# EAGLE design hw2 (EAGLE 9.3.0)
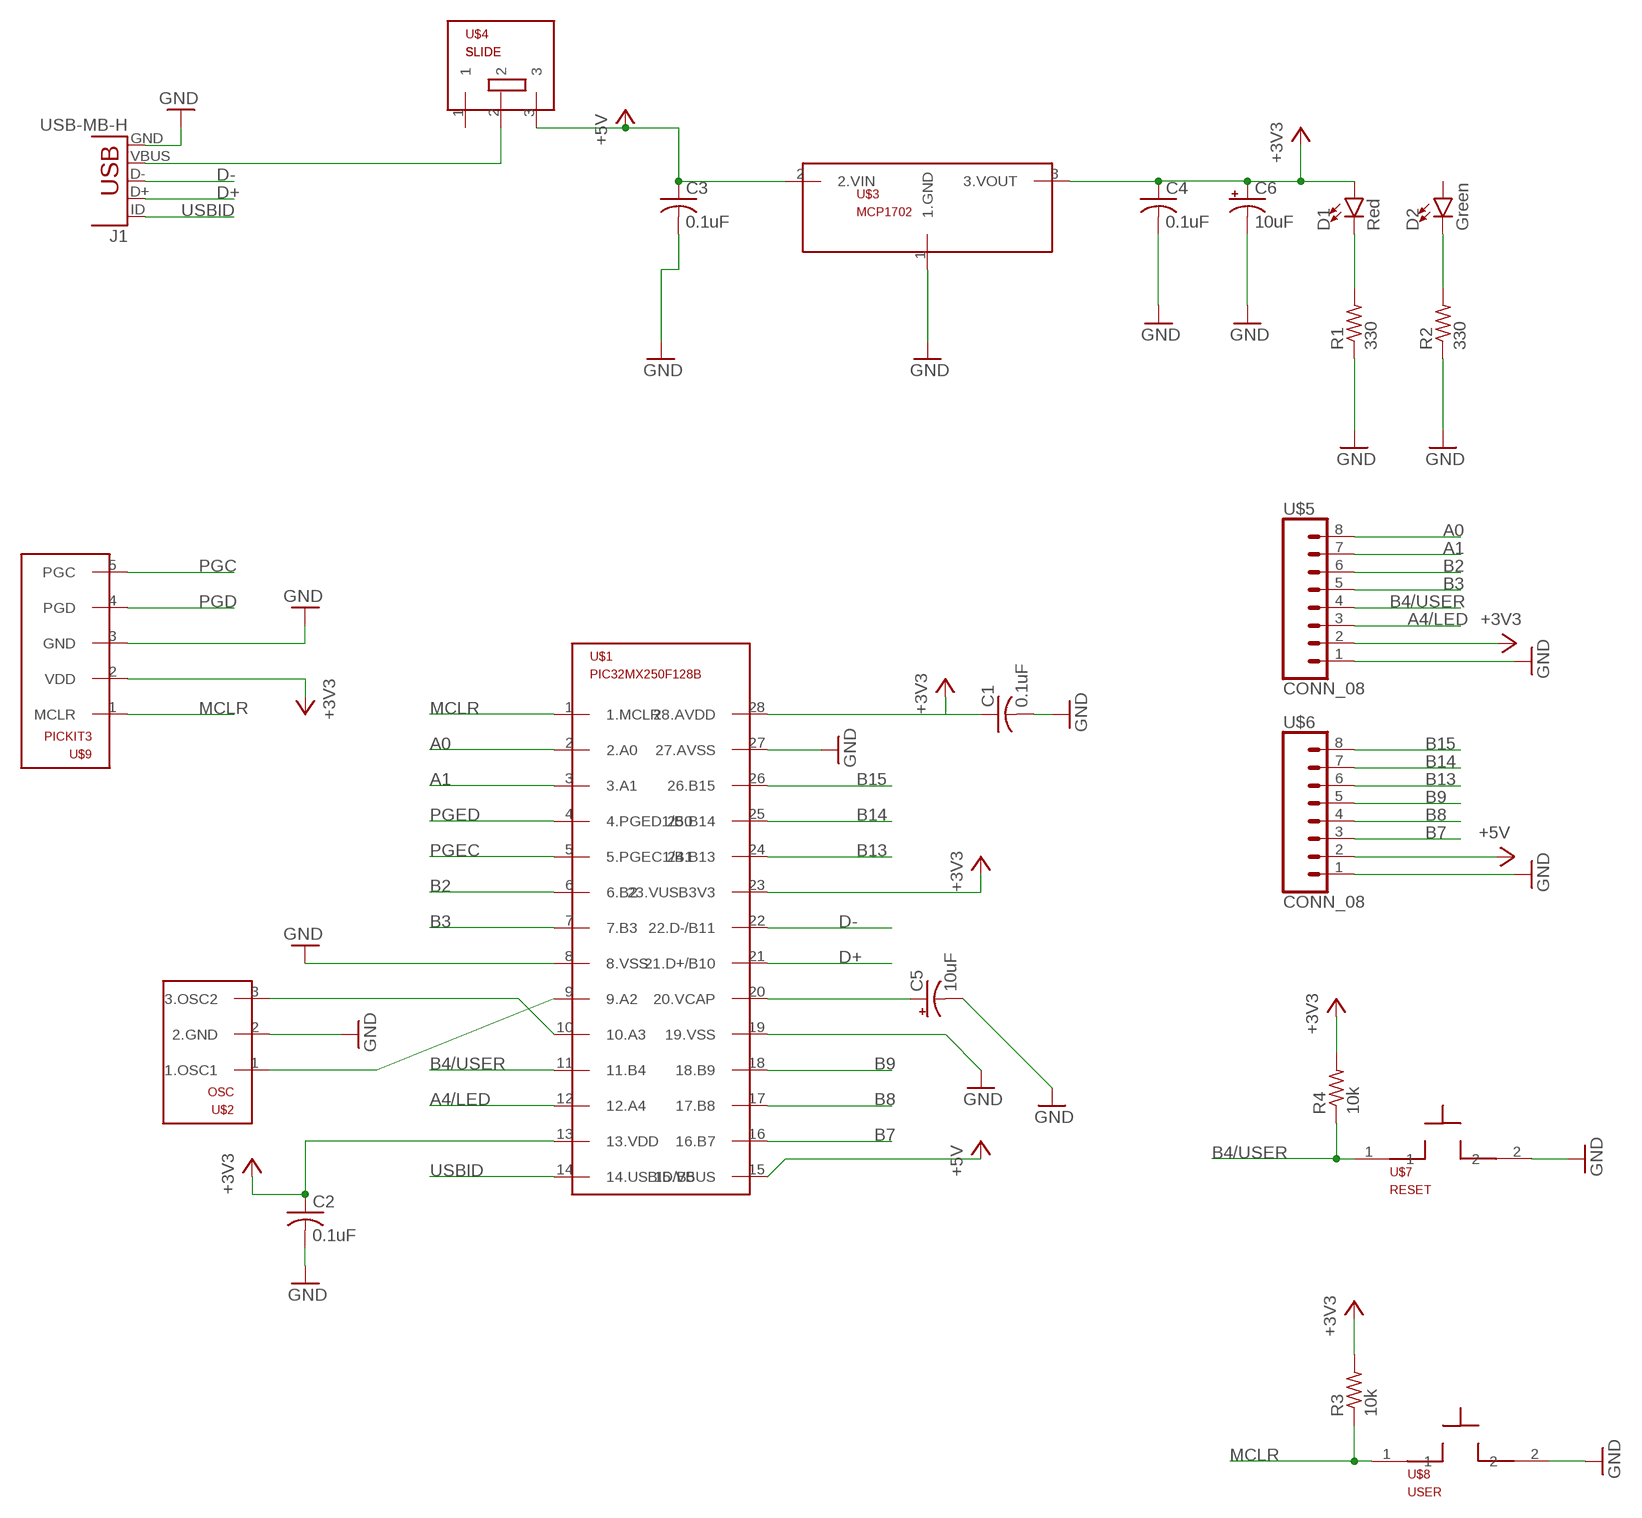
[diagram p0: schematic, sheet 1]

## Parts
C1  0.1uF  C-US025-025X050  [C025-025X050]
C2  0.1uF  C-US025-025X050  [C025-025X050]
C3  0.1uF  C-US025-025X050  [C025-025X050]
C4  0.1uF  C-US025-025X050  [C025-025X050]
C5  10uF  CPOL-USB45181B  [B45181B]
C6  10uF  CPOL-USB45181B  [B45181B]
D1  Red  LED3MM  [LED_3MM]
D2  Green  LED3MM  [LED_3MM]
J1  USB-MB-H  [USB-MB-H]
R1  330  R-US_0207/10  [0207/10]
R2  330  R-US_0207/10  [0207/10]
R3  10k  R-US_0207/10  [0207/10]
R4  10k  R-US_0207/10  [0207/10]
U$1  PIC32MX250F128B  [DIL28-3]
U$2  OSC  [OSC]
U$3  MCP1702  [TO92]
U$4  SLIDE  [SLIDE]
U$5  CONN_08  [1X08]
U$6  CONN_08  [1X08]
U$7  RESET  PB  [PB]
U$8  USER  PB  [PB]
U$9  PICKIT3  [1X05]

## Nets
+3V3: C2.1 C4.1 C6.+ D1.A R3.2 R4.2 U$1.13(13.VDD) U$1.23(23.VUSB3V3) U$3.3(3.VOUT) U$5.2 U$9.2(VDD)
+5V: C3.1 U$1.15(15.VBUS) U$3.2(2.VIN) U$4.3 U$6.2
A0: U$1.2(2.A0) U$5.8
A1: U$1.3(3.A1) U$5.7
A4/LED: U$1.12(12.A4) U$5.3
B2: U$1.6(6.B2) U$5.6
B3: U$1.7(7.B3) U$5.5
B4/USER: R4.1 U$1.11(11.B4) U$5.4 U$7.1
B7: U$1.16(16.B7) U$6.3
B8: U$1.17(17.B8) U$6.4
B9: U$1.18(18.B9) U$6.5
B13: U$1.24(24.B13) U$6.6
B14: U$1.25(25.B14) U$6.7
B15: U$1.26(26.B15) U$6.8
D+: J1.D+ U$1.21(21.D+/B10)
D-: J1.D- U$1.22(22.D-/B11)
GND: C1.2 C2.2 C3.2 C4.2 C5.- C6.- J1.GND R1.1 R2.1 U$1.8(8.VSS) U$1.19(19.VSS) U$1.27(27.AVSS) U$2.2(2.GND) U$3.1(1.GND) U$5.1 U$6.1 U$7.2 U$8.2 U$9.3(GND)
MCLR: R3.1 U$1.1(1.MCLR) U$8.1 U$9.1(MCLR)
N$1: J1.VBUS U$4.2
N$2: D1.K(C) R1.2
N$3: D2.K(C) R2.2
N$4: U$1.9(9.A2) U$2.1(1.OSC1)
N$5: U$1.10(10.A3) U$2.3(3.OSC2)
N$7: C5.+ U$1.20(20.VCAP)
N$26: C1.1 U$1.28(28.AVDD)
PGC: U$9.5(PGC)
PGD: U$9.4(PGD)
PGEC: U$1.5(5.PGEC1/B1)
PGED: U$1.4(4.PGED1/B0)
USBID: J1.ID U$1.14(14.USBID/B5)
Unconnected: D2.A U$4.1

## Library data of the parts
C1 C2 C4 = hw2:C-US: CAPACITOR, American symbol; SPICEPREFIX: C
C3 = hw2:C-US: CAPACITOR, American symbol; SPICEPREFIX: 0.1uF
C5 C6 = hw2:CPOL-US: POLARIZED CAPACITOR, American symbol; SPICEPREFIX: C
D1 D2 = SparkFun-LED:LED: LED (Generic) Standard schematic elements and footprints for 5mm, 3mm, 1206, and 0603 sized LEDs. Generic LEDs with no color specified.; PROD_ID: DIO-08794
J1 = hw2:USB: USB Connectors USB-B-PTH is fully proven SKU : PRT-00139/CONN-08278 USB-miniB is fully proven SKU : PRT-00587 USB-A-PCB is untested. USB-A-H is throughly reviewed, but untested. Spark Fun Electronics SKU : PRT-00437 USB-B-SMT is throughly reviewed, but untested. Needs silkscreen touching up. USB-A-S has not been used/tested USB-MB-H has not been used/tested USB-MICROB has been used. CONN-09505
R1-R4 = hw2:R-US_: RESISTOR, American symbol; SPICEPREFIX: R
U$1 = hw2:PIC32MX250F128B
U$2 = hw2:OSC
U$3 = hw2:MCP1702
U$4 = hw2:SLIDE
U$5 U$6 = hw2:CONN_08
U$7 U$8 = hw2:PB
U$9 = hw2:PICKIT3

## Board
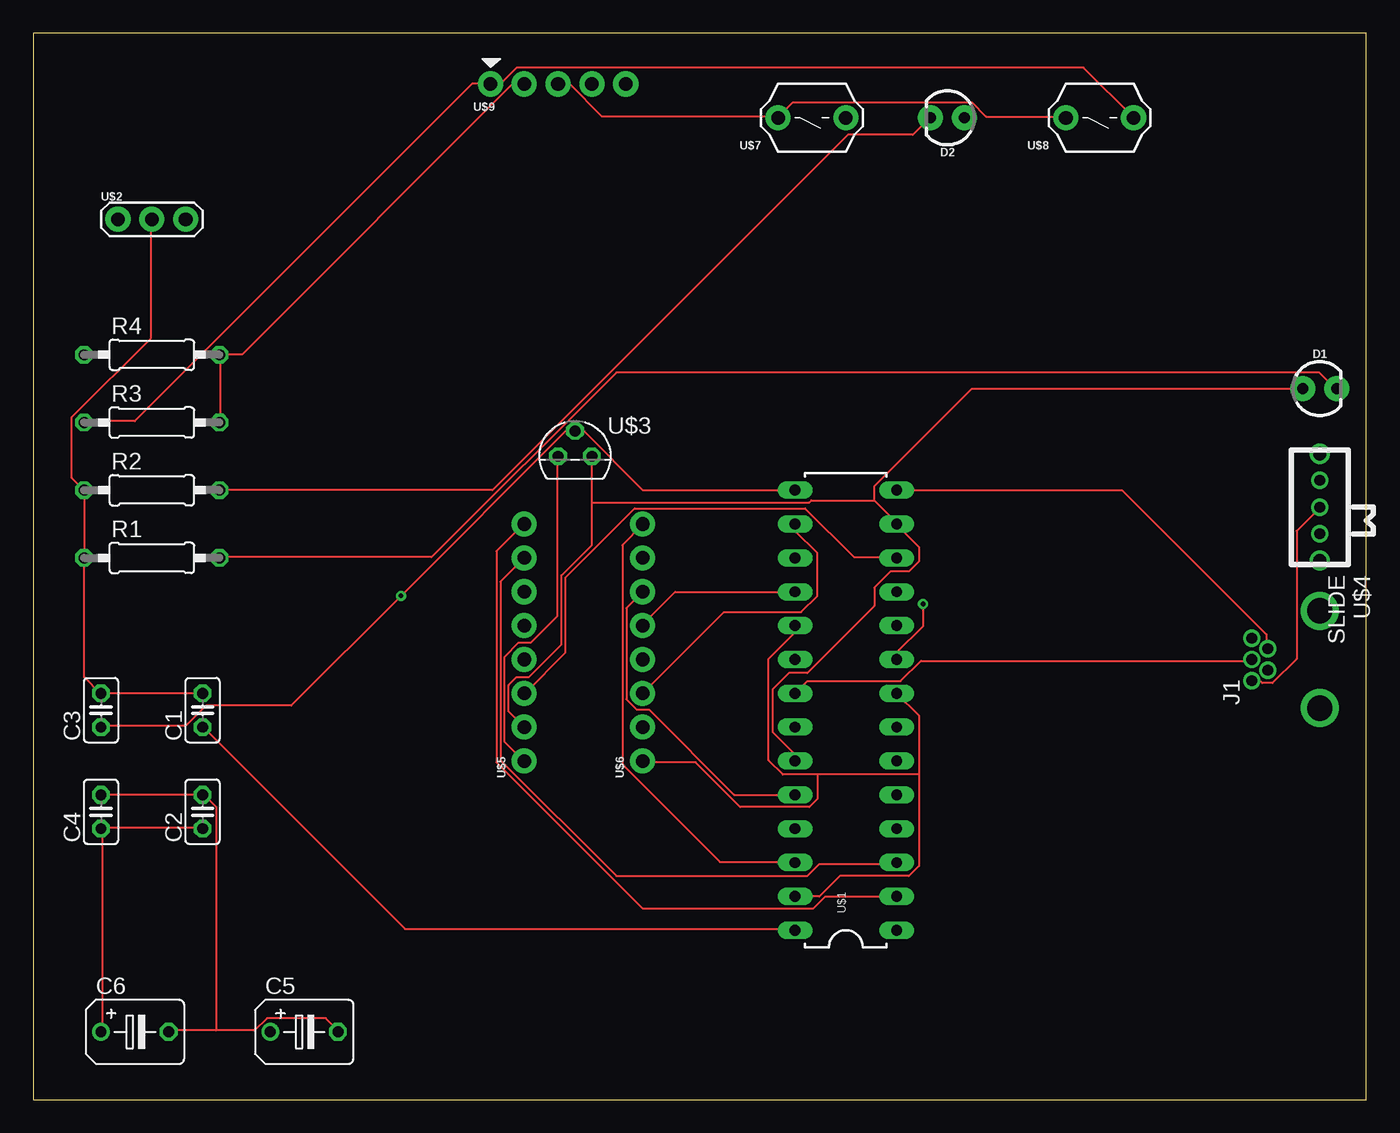
[diagram p1: board, top side]
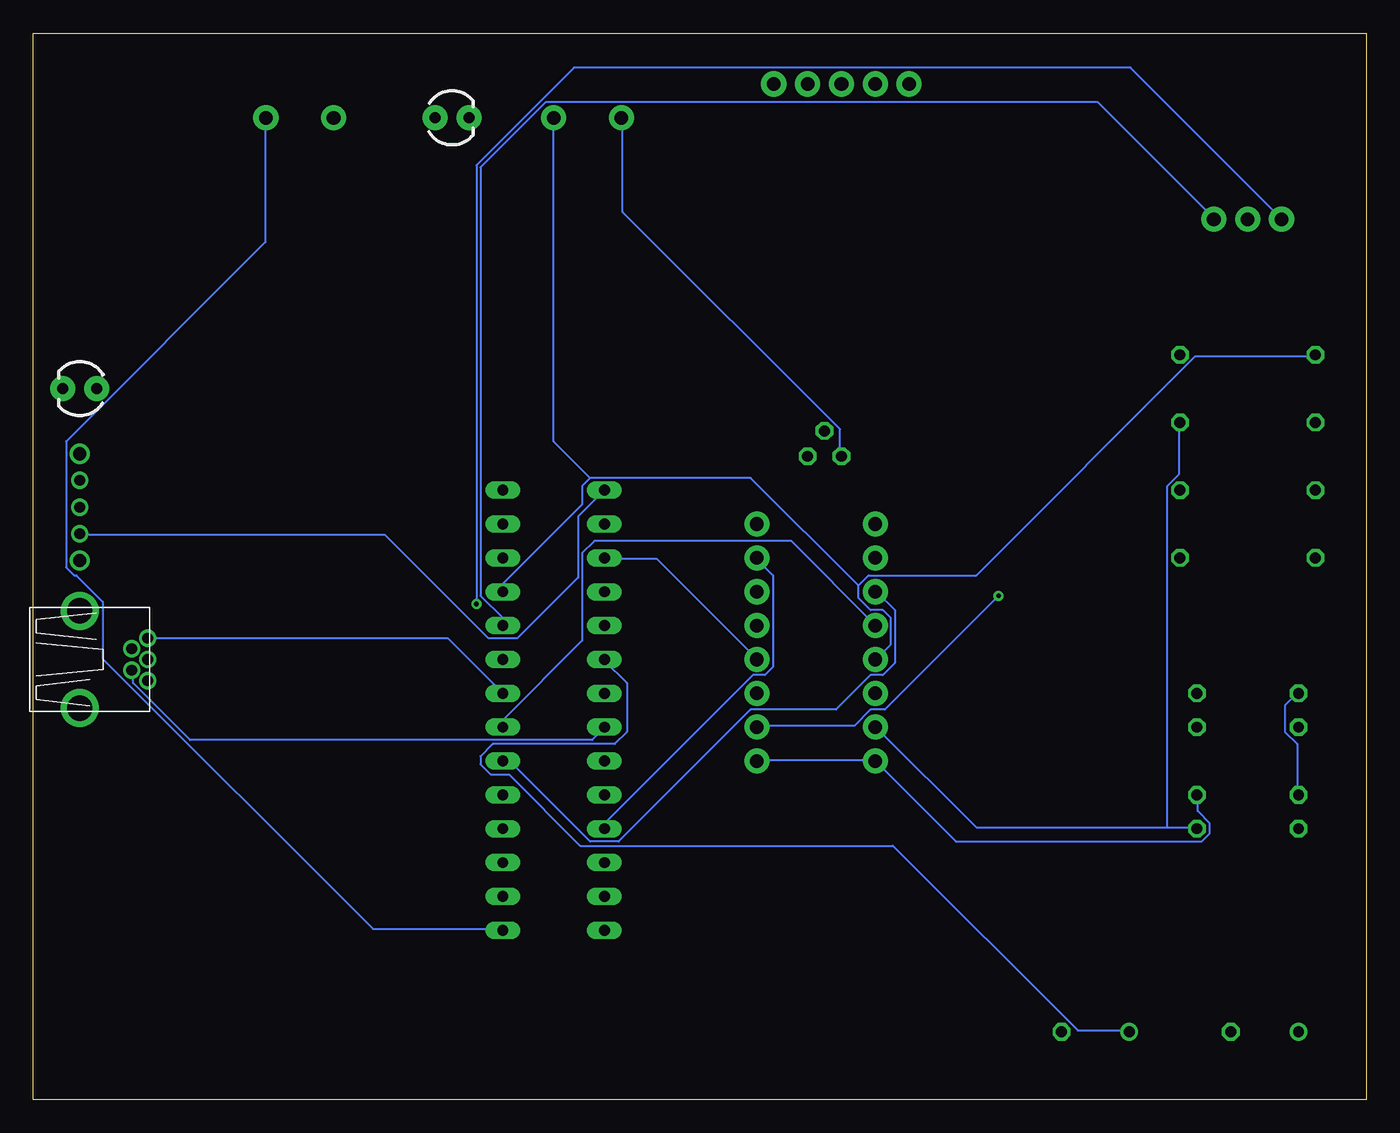
[diagram p2: board, bottom side, seen from below]

Size 100 x 80 mm. Coordinates in mm from the lower left corner, seen from the top.
Outline: 0,0 100,0 100,80 0,80 0,0
Copper layers (1*16): Top 0.035mm / dielectric 1.5mm / Bottom 0.035mm
Design rules "default": minimum track width 6mil, minimum drill 0.35mm, track to track 6mil, track to pad 6mil, pad to pad 6mil, via to via 6mil, smd to smd 6mil, copper to edge 40mil, drill to drill 6mil, minimum pad ring 10mil, minimum via ring 8mil, stop-mask expansion 4mil, vias tented up to drill 0mil, thermal gap 10mil

### Footprints (pad centres in the part's own frame; a part is rotated, then mirrored left to right if it is on the bottom)
C025-025X050 = drill 0.813 octagon: 1 -1.27,0; 2 1.27,0
B45181B = drill 0.813: + -2.54,0 | drill 0.813 octagon: - 2.54,0
LED_3MM = drill 0.813 pad 1.88: A -1.27,0; K 1.27,0
USB-MB-H = drill 0.8: D+ 5.1,0; D- 3.9,0.8; GND 5.1,-1.6; ID 3.9,-0.8; VBUS 5.1,1.6 | drill 1.9: P$6 0,-3.65; P$7 0,3.65
0207/10 = drill 0.813 octagon: 1 -5.08,0; 2 5.08,0
DIL28-3 = drill 0.813 long: 1 -16.51,-3.81; 2 -13.97,-3.81; 3 -11.43,-3.81; 4 -8.89,-3.81; 5 -6.35,-3.81; 6 -3.81,-3.81; 7 -1.27,-3.81; 8 1.27,-3.81; 9 3.81,-3.81; 10 6.35,-3.81; 11 8.89,-3.81; 12 11.43,-3.81; 13 13.97,-3.81; 14 16.51,-3.81; 15 16.51,3.81; 16 13.97,3.81; 17 11.43,3.81; 18 8.89,3.81; 19 6.35,3.81; 20 3.81,3.81; 21 1.27,3.81; 22 -1.27,3.81; 23 -3.81,3.81; 24 -6.35,3.81; 25 -8.89,3.81; 26 -11.43,3.81; 27 -13.97,3.81; 28 -16.51,3.81
OSC = drill 1.016 pad 1.88: 1 -2.54,0; 2 0,0; 3 2.54,0
TO92 = drill 0.813 octagon: 1 -1.27,0; 2 0,1.905; 3 1.27,0
SLIDE = drill 0.8: 1 -2,0; 2 0,0; 3 2,0 | drill 1: P$1 -4,0; P$2 4,0
1X08 = drill 1.016 pad 1.88: 1 0,0; 2 2.54,0; 3 5.08,0; 4 7.62,0; 5 10.16,0; 6 12.7,0; 7 15.24,0; 8 17.78,0
PB = drill 1.016 pad 1.88: 1 -2.54,0; 2 2.54,0
1X05 = drill 1.016 pad 1.88: 1 0,0; 2 2.54,0; 3 5.08,0; 4 7.62,0; 5 10.16,0

### Placement (x,y rotation side)
C1  12.7,29.21 90 top
C2  12.7,21.59 90 top
C3  5.08,29.21 90 top
C4  5.08,21.59 90 top
C5  20.32,5.08 0 top
C6  7.62,5.08 0 top
D1  96.52,53.34 0 top
D2  68.58,73.66 180 top
J1  96.52,33.02 180 top
R1  8.89,40.64 0 top
R2  8.89,45.72 0 top
R3  8.89,50.8 0 top
R4  8.89,55.88 0 top
U$1  60.96,29.21 90 top
U$2  8.89,66.04 0 top
U$3  40.64,48.26 0 top
U$4  96.52,44.45 270 top
U$5  36.83,25.4 90 top
U$6  45.72,25.4 90 top
U$7  58.42,73.66 180 top
U$8  80.01,73.66 180 top
U$9  34.29,76.2 0 top

### Tracks (layer width: path | path; a pad name or v marks a point on that pad's centre or on a via)
+3V3
  Top 0.152: U$1.23 57.15,25.91 55.47,27.58 55.47,30.79 56.69,32 58.06,32 63.09,37.03 63.09,38.41 64.31,39.62 65.68,39.62 66.45,40.39 66.45,41.45 64.77,43.13 U$1.13 64.77,43.28 63.09,44.96 | D1.A 70.41,53.34 63.09,46.02 63.09,44.96 | R3.2 14.02,50.9 14.02,55.78 R4.2 14.02,55.93 15.7,55.93 35.97,76.2 U$9.2 | C6.+ 5.18,5.18 5.18,20.27 C4.1 5.18,20.42 12.65,20.42 C2.1 | 41.91,44.81 41.91,41.6 39.62,39.32 39.62,34.14 37.19,31.7 36.27,31.7 35.66,31.09 35.66,29.11 U$5.2 | 41.91,44.81 U$3.3 | 63.09,44.96 58.37,44.96 58.22,44.81 41.91,44.81
  Bottom 0.152: 14.94,20.42 29.26,20.42 36.73,27.89 U$5.2 | 14.94,20.42 12.8,20.42 C2.1 | 14.94,20.42 14.94,46.02 14.02,46.94 14.02,50.75 R3.2
+5V  (via drill 0.35)
  Top 0.152: C3.1 5.18,28.04 11.43,28.04 12.95,29.57 19.36,29.57 v27.58,37.8 39.93,50.14 40.54,50.14 U$3.2 40.69,50.14 41.3,50.14 45.72,45.72 U$1.15
  Bottom 0.152: U$1.15 59.13,43.74 59.13,39.17 63.7,34.59 65.84,34.59 73.61,42.37 96.47,42.37 U$4.3 | v27.58,37.8 36.12,29.26 37.19,29.26 38.41,28.04 45.72,28.04 U$6.2
A0
  Top 0.152: U$1.2 59.44,15.24 58.52,14.33 45.72,14.33 34.75,25.3 34.75,41.15 36.73,43.13 U$5.8
A1
  Top 0.152: U$5.7 35.05,38.86 35.05,25.45 43.74,16.76 58.06,16.76 58.98,17.68 64.77,17.68 U$1.3
A4/LED
  Top 0.152: U$1.12 64.77,40.69 61.57,40.69 57.91,44.35 45.11,44.35 39.93,39.17 39.93,33.53 36.88,30.48 U$5.3
B2
  Bottom 0.152: U$1.6 64.77,25.3 64.16,25.3 58.22,19.36 56.08,19.36 46.18,29.26 39.78,29.26 37.19,31.85 36.27,31.85 35.36,32.77 35.36,36.73 36.73,38.1 U$5.6
B3
  Bottom 0.152: U$1.7 64.77,28.5 58.83,34.44 58.83,41 57.91,41.91 43.13,41.91 36.88,35.66 U$5.5
B4/USER
  Bottom 0.152: 38.1,38.56 37.34,39.32 29.26,39.32 12.8,55.78 3.81,55.78 R4.1 | 38.1,38.56 38.1,37.64 37.19,36.73 36.27,36.73 35.66,36.12 35.66,34.14 36.73,33.07 U$5.4 | U$1.11 64.77,38.71 58.83,44.65 58.83,46.02 58.22,46.63 | 58.22,46.63 46.18,46.63 38.1,38.56 | U$7.1 60.96,49.38 58.22,46.63
B7
  Top 0.152: U$1.16 57.15,42.67 58.83,41 58.83,37.8 57.61,36.58 51.82,36.58 U$6.3
B8
  Bottom 0.152: U$1.17 57.15,40.54 53.19,40.54 45.72,33.07 U$6.4
B9
  Top 0.152: U$1.18 48.16,38.1 45.72,35.66 U$6.5
B13
  Top 0.152: U$1.24 52.58,22.86 46.18,29.26 45.26,29.26 44.5,30.02 44.5,36.88 U$6.6
B14
  Bottom 0.152: U$1.25 57.15,20.73 46.02,31.85 45.11,31.85 44.5,32.46 44.5,39.32 45.72,40.54 U$6.7
B15
  Top 0.152: U$1.26 57.15,17.83 51.51,17.83 44.2,25.15 44.2,41.6 45.72,43.13 U$6.8
D+
  Top 0.152: U$1.21 58.06,31.39 65.08,31.39 66.6,32.92 91.29,32.92 J1.D+
D-
  Bottom 0.152: J1.D- 92.51,32.16 92.51,31.24 88.24,26.98 58.06,26.98 57.15,27.89 U$1.22
GND
  Top 0.152: U$2.2 8.84,65.99 8.84,57.15 2.9,51.21 2.9,46.63 R2.1 R1.1 3.81,31.7 5.03,30.48 C3.2 C1.2 | 13.72,5.18 16.61,5.18 17.53,6.1 21.95,6.1 22.86,5.18 C5.- | 13.72,5.18 10.21,5.18 C6.- | C4.2 C2.2 12.8,22.86 13.72,21.95 13.72,5.18 | U$9.3 40.23,76.2 42.67,73.76 55.78,73.76 U$7.2 55.93,73.76 57,74.83 70.41,74.83 71.48,73.76 77.42,73.76 U$8.2 | U$3.1 39.32,48.16 39.32,36.27 37.34,34.29 36.42,34.29 35.36,33.22 35.36,26.82 36.73,25.45 U$5.1 | U$1.27 58.98,15.24 60.5,16.76 65.68,16.76 66.45,17.53 66.45,24.38 | 66.45,24.38 66.45,28.8 U$1.8 | U$1.19 57.15,35.05 55.17,33.07 55.17,25.45 56.24,24.38 58.83,24.38 | 66.45,24.38 58.83,24.38 | 58.83,24.38 58.83,22.55 58.22,21.95 53.03,21.95 49.68,25.3 45.72,25.3 U$6.1
  Bottom 0.152: C4.2 5.18,22.86 5.18,26.67 6.1,27.58 6.1,29.57 5.18,30.48 C3.2 | U$6.1 45.72,25.45 36.88,25.45 U$5.1 30.79,19.36 12.34,19.36 11.73,19.96 11.73,20.73 12.65,21.64 12.65,22.86 C2.2 | U$1.8 68.89,34.59 91.29,34.59 J1.GND | U$7.2 55.78,73.61 55.78,66.6 39.47,50.29 39.47,48.31 U$3.1
MCLR
  Top 0.152: R3.1 3.81,50.9 7.62,50.9 32.92,76.2 U$9.1 35.05,76.2 36.27,77.42 78.79,77.42 U$8.1
  Bottom 0.152: U$1.1 64.77,12.8 74.52,12.8 94.79,33.07 94.79,37.34 96.77,39.32 96.93,39.32 97.54,39.93 97.54,49.38 82.6,64.31 82.6,73.61 U$8.1
N$1
  Top 0.152: J1.VBUS 91.44,31.39 92.05,31.39 92.2,31.24 92.96,31.24 94.79,33.07 94.79,42.67 96.47,44.35 U$4.2
N$2
  Top 0.152: R1.2 14.02,40.69 29.87,40.69 43.74,54.56 96.47,54.56 97.69,53.34 D1.K
N$3
  Top 0.152: R2.2 34.44,45.72 61.11,72.39 65.99,72.39 67.21,73.61 D2.K
N$4  (via drill 0.35)
  Top 0.152: U$1.9 64.77,33.53 66.75,35.51 v66.75,37.19
  Bottom 0.152: v66.75,37.19 66.75,70.1 59.44,77.42 17.68,77.42 6.4,66.14 U$2.1
N$5
  Bottom 0.152: U$1.10 64.77,36.12 66.45,37.8 66.45,69.95 61.57,74.83 20.12,74.83 11.43,66.14 U$2.3
N$7
  Bottom 0.152: C5.+ 17.83,5.18 21.64,5.18 35.51,19.05 58.98,19.05 64.31,24.38 65.68,24.38 66.45,25.15 66.45,25.76 65.53,26.67 56.39,26.67 55.47,27.58 55.47,31.24 57.15,32.92 U$1.20
N$26
  Top 0.152: U$1.28 57.15,12.8 27.89,12.8 12.8,27.89 C1.1
USBID
  Top 0.152: U$1.14 81.69,45.72 92.51,34.9 92.51,33.83 J1.ID